# EAGLE schematic esp8266 (EAGLE 7.5.0)
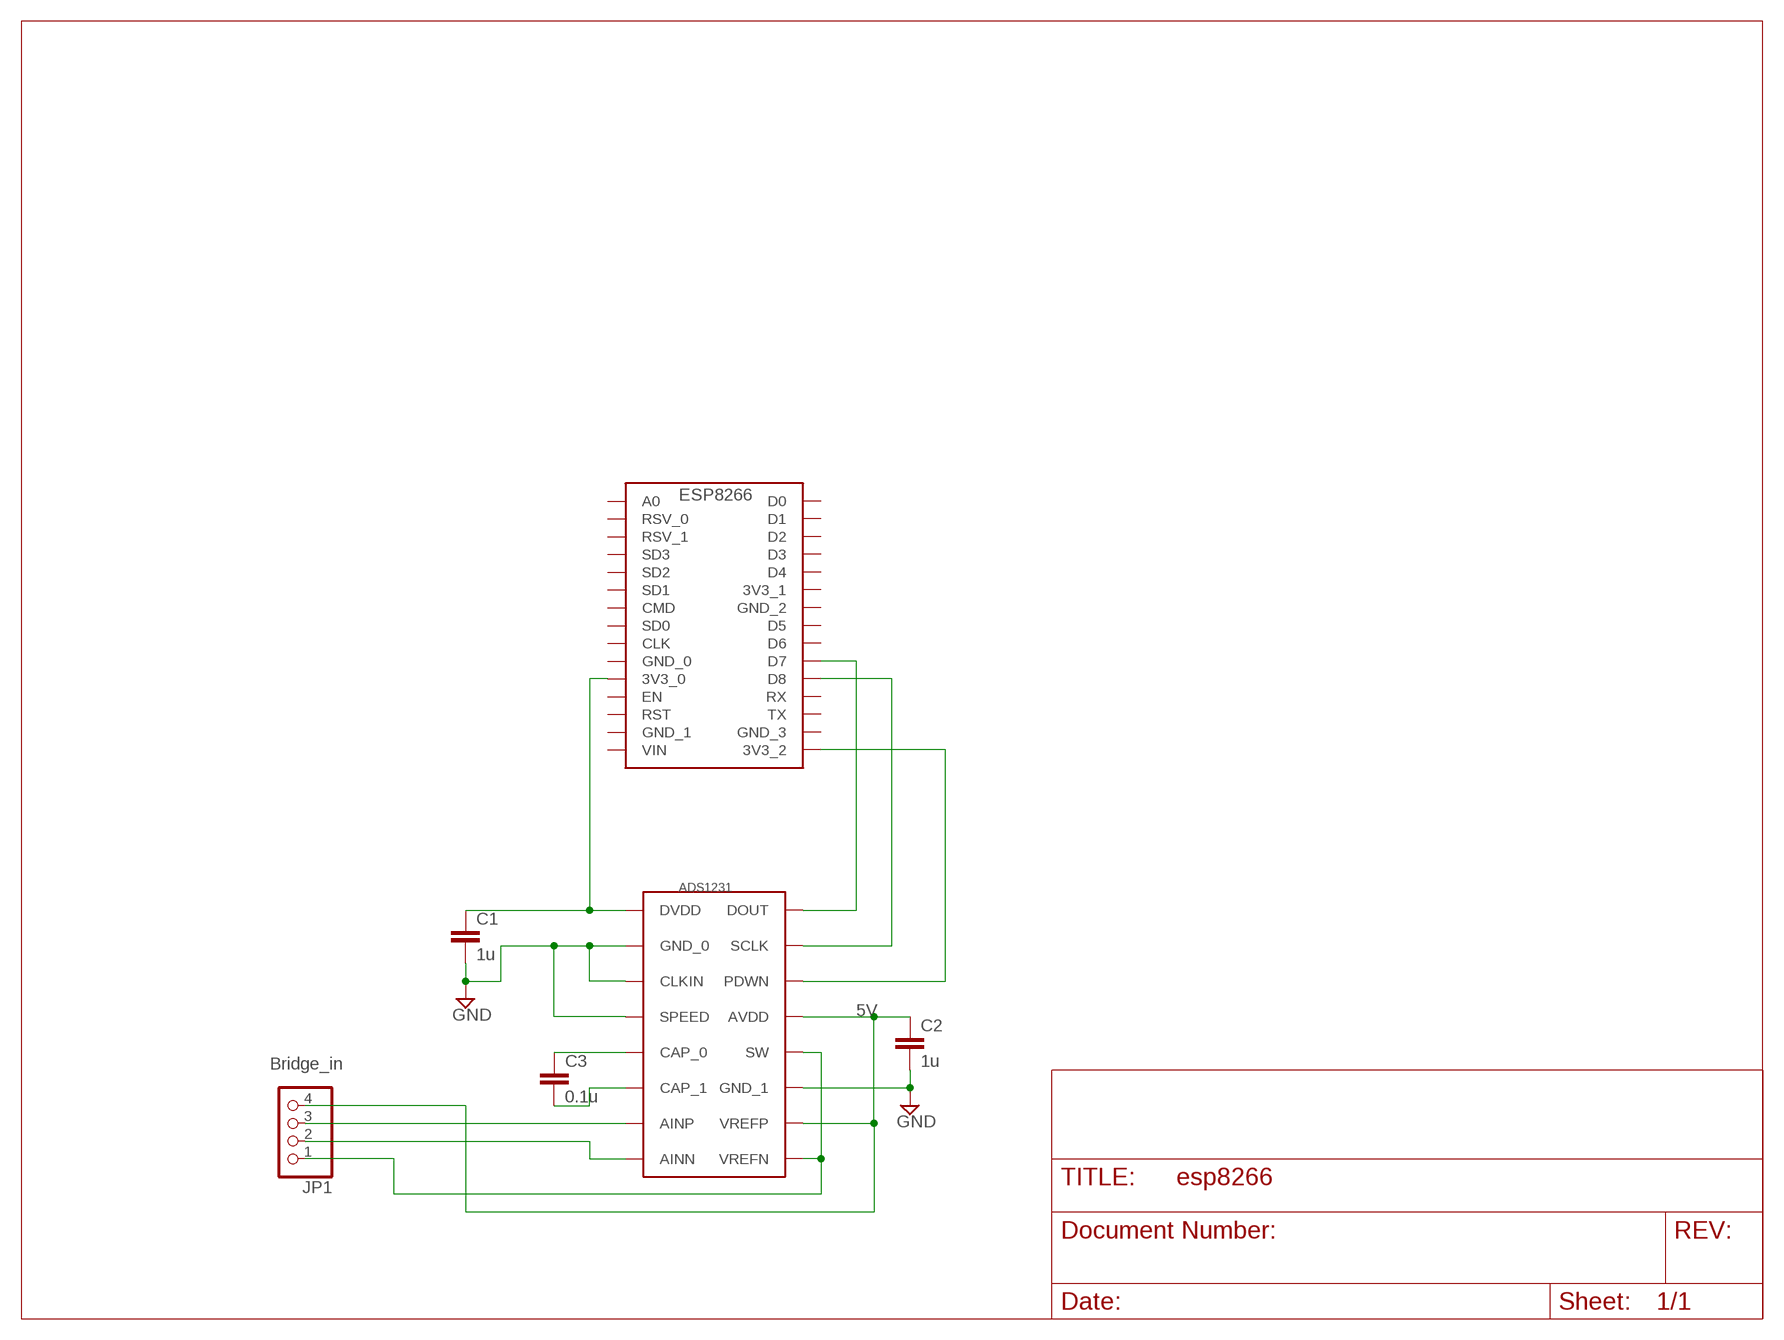
[diagram p0: schematic, sheet 1]

## Parts
ADS1231  ADS1231  [ADS1231]
C1  1u  C-EUC0805  [C0805]
C2  1u  C-EUC0805  [C0805]
C3  0.1u  C-EUC0805  [C0805]
ESP8266  ESP8266_DEV_NODEMCU_AMICA  [ESP*266_DEV]
JP1  PINHD-1X4  [1X04]

## Nets
5V: ADS1231.AVDD ADS1231.VREFP C2.1 JP1.4
GND: ADS1231.CLKIN ADS1231.GND_0 ADS1231.GND_1 ADS1231.SPEED C1.2 C2.2
N$1: ADS1231.DOUT ESP8266.D7
N$2: ADS1231.CAP_0 C3.1
N$3: ADS1231.CAP_1 C3.2
N$5: ADS1231.AINP JP1.3
N$6: ADS1231.AINN JP1.2
N$7: ADS1231.SW ADS1231.VREFN JP1.1
N$8: ADS1231.SCLK ESP8266.D8
N$9: ADS1231.PDWN ESP8266.3V3_2
V3.3: ADS1231.DVDD C1.1 ESP8266.3V3_0
Unconnected: ESP8266.3V3_1 ESP8266.A0 ESP8266.CLK ESP8266.CMD ESP8266.D0 ESP8266.D1 ESP8266.D2 ESP8266.D3 ESP8266.D4 ESP8266.D5 ESP8266.D6 ESP8266.EN ESP8266.GND_0 ESP8266.GND_1 ESP8266.GND_2 ESP8266.GND_3 ESP8266.RST ESP8266.RSV_0 ESP8266.RSV_1 ESP8266.RX ESP8266.SD0 ESP8266.SD1 ESP8266.SD2 ESP8266.SD3 ESP8266.TX ESP8266.VIN

## Notes on the sheet
- Bridge_in

## Library data of the parts
ADS1231 = capstone_polly:ADS1231
C1 C2 = resistor:C-EU: CAPACITOR, European symbol
C3 = rcl:C-EU: CAPACITOR, European symbol
ESP8266 = capstone_polly:ESP8266_DEV_NODEMCU_AMICA
JP1 = pinhead:PINHD-1X4: PIN HEADER